# EAGLE design ETEST02 (EAGLE 7.3.0)
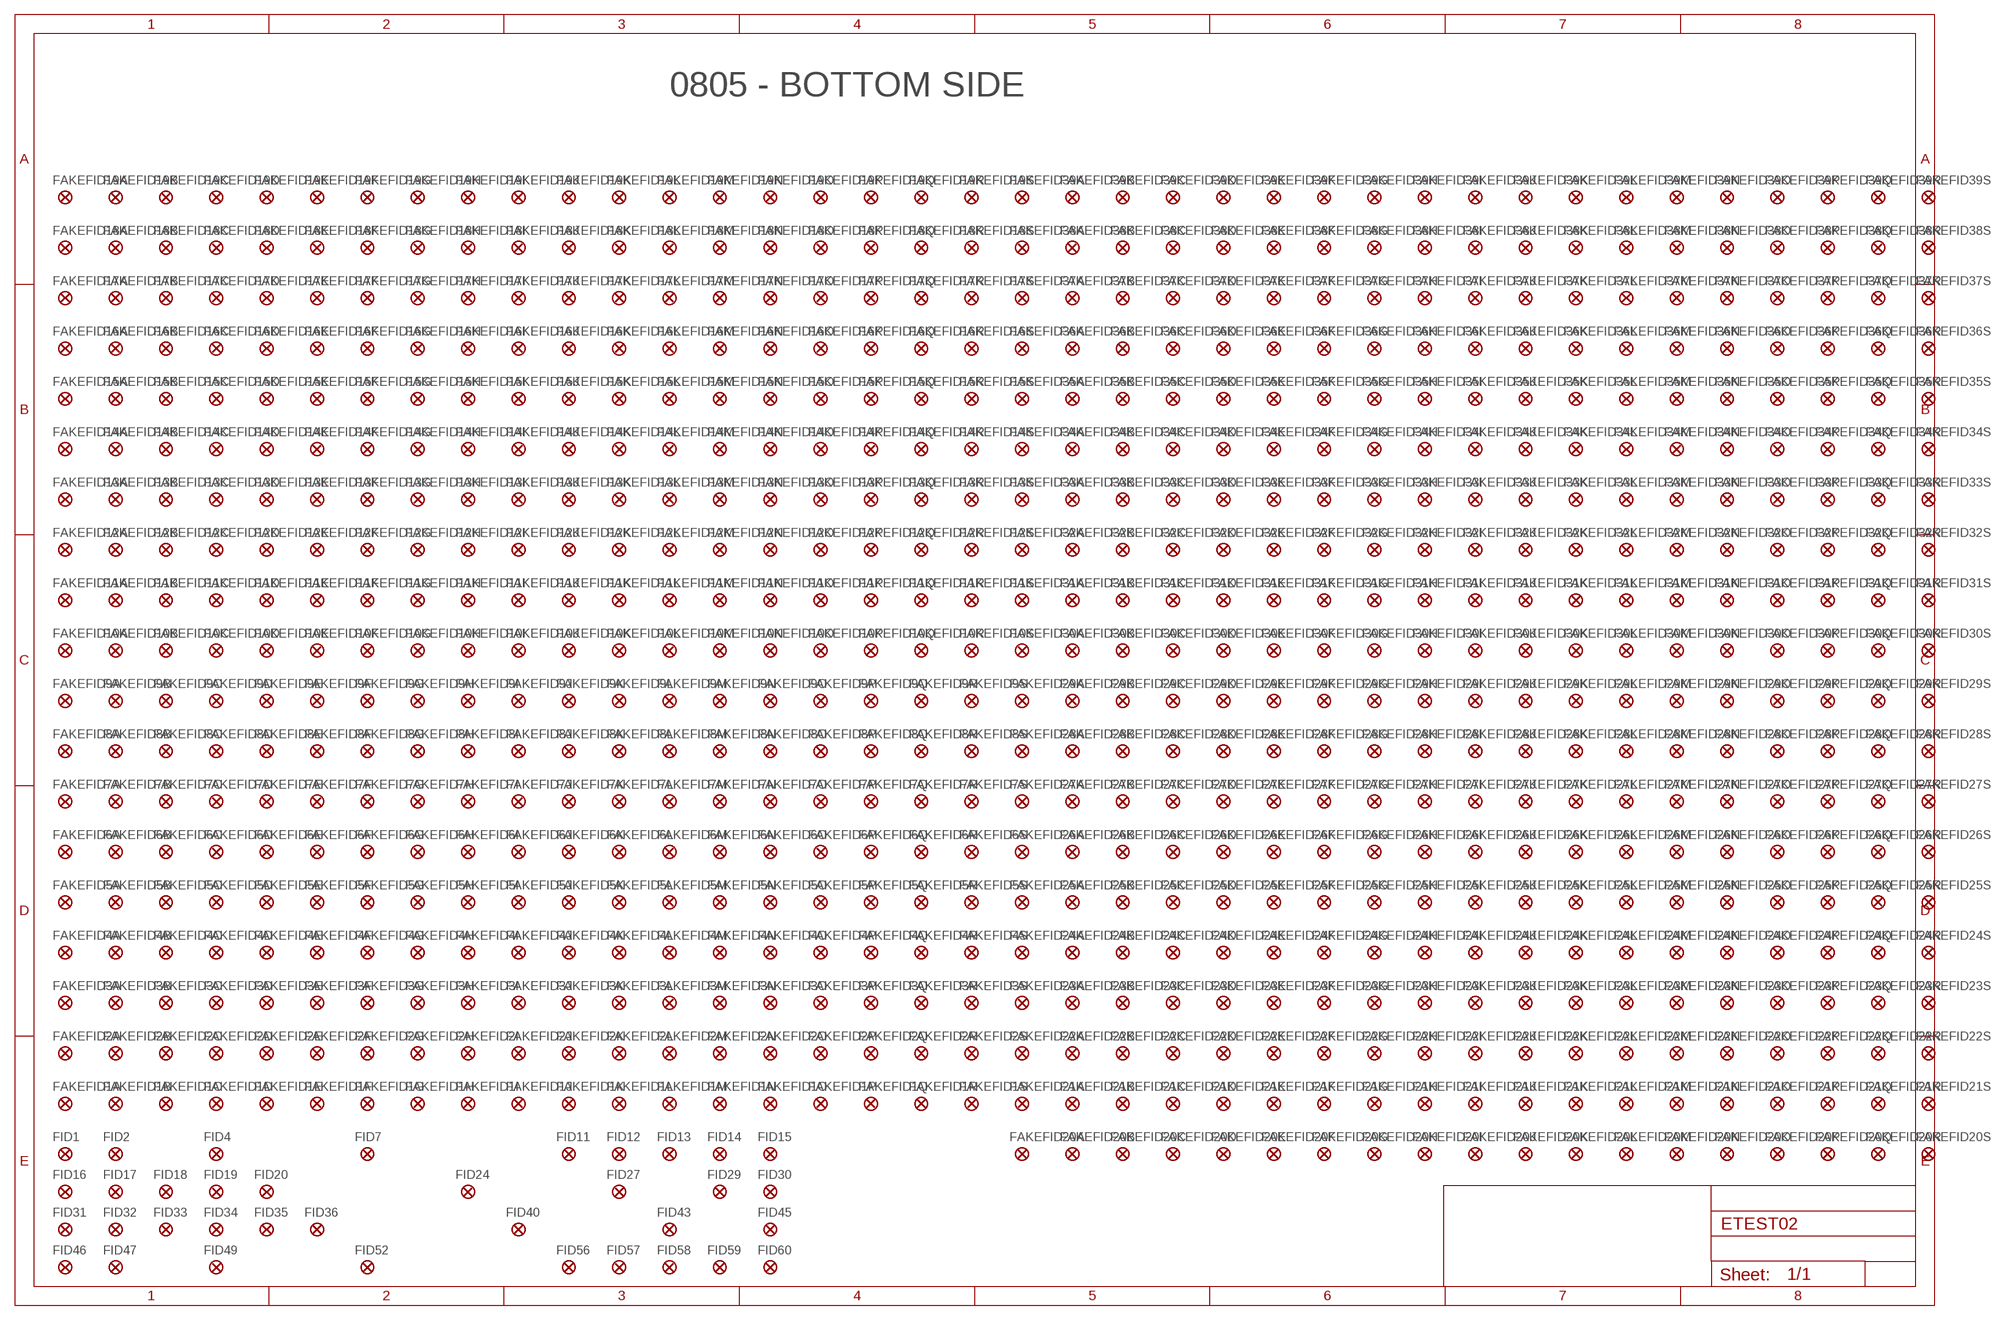
[diagram p0: schematic, sheet 1]

## Parts
FAKEFID1  FIDUCIAL_19X  [FIDUCIAL_19X]
FAKEFID2  FIDUCIAL_19X  [FIDUCIAL_19X]
FAKEFID3  FIDUCIAL_19X  [FIDUCIAL_19X]
FAKEFID4  FIDUCIAL_19X  [FIDUCIAL_19X]
FAKEFID5  FIDUCIAL_19X  [FIDUCIAL_19X]
FAKEFID6  FIDUCIAL_19X  [FIDUCIAL_19X]
FAKEFID7  FIDUCIAL_19X  [FIDUCIAL_19X]
FAKEFID8  FIDUCIAL_19X  [FIDUCIAL_19X]
FAKEFID9  FIDUCIAL_19X  [FIDUCIAL_19X]
FAKEFID10  FIDUCIAL_19X  [FIDUCIAL_19X]
FAKEFID11  FIDUCIAL_19X  [FIDUCIAL_19X]
FAKEFID12  FIDUCIAL_19X  [FIDUCIAL_19X]
FAKEFID13  FIDUCIAL_19X  [FIDUCIAL_19X]
FAKEFID14  FIDUCIAL_19X  [FIDUCIAL_19X]
FAKEFID15  FIDUCIAL_19X  [FIDUCIAL_19X]
FAKEFID16  FIDUCIAL_19X  [FIDUCIAL_19X]
FAKEFID17  FIDUCIAL_19X  [FIDUCIAL_19X]
FAKEFID18  FIDUCIAL_19X  [FIDUCIAL_19X]
FAKEFID19  FIDUCIAL_19X  [FIDUCIAL_19X]
FAKEFID20  FIDUCIAL_19X  [FIDUCIAL_19X]
FAKEFID21  FIDUCIAL_19X  [FIDUCIAL_19X]
FAKEFID22  FIDUCIAL_19X  [FIDUCIAL_19X]
FAKEFID23  FIDUCIAL_19X  [FIDUCIAL_19X]
FAKEFID24  FIDUCIAL_19X  [FIDUCIAL_19X]
FAKEFID25  FIDUCIAL_19X  [FIDUCIAL_19X]
FAKEFID26  FIDUCIAL_19X  [FIDUCIAL_19X]
FAKEFID27  FIDUCIAL_19X  [FIDUCIAL_19X]
FAKEFID28  FIDUCIAL_19X  [FIDUCIAL_19X]
FAKEFID29  FIDUCIAL_19X  [FIDUCIAL_19X]
FAKEFID30  FIDUCIAL_19X  [FIDUCIAL_19X]
FAKEFID31  FIDUCIAL_19X  [FIDUCIAL_19X]
FAKEFID32  FIDUCIAL_19X  [FIDUCIAL_19X]
FAKEFID33  FIDUCIAL_19X  [FIDUCIAL_19X]
FAKEFID34  FIDUCIAL_19X  [FIDUCIAL_19X]
FAKEFID35  FIDUCIAL_19X  [FIDUCIAL_19X]
FAKEFID36  FIDUCIAL_19X  [FIDUCIAL_19X]
FAKEFID37  FIDUCIAL_19X  [FIDUCIAL_19X]
FAKEFID38  FIDUCIAL_19X  [FIDUCIAL_19X]
FAKEFID39  FIDUCIAL_19X  [FIDUCIAL_19X]
FID1  FIDUCIAL  [FIDUCIAL]
FID2  FIDUCIAL  [FIDUCIAL]
FID4  FIDUCIAL  [FIDUCIAL]
FID7  FIDUCIAL  [FIDUCIAL]
FID11  FIDUCIAL  [FIDUCIAL]
FID12  FIDUCIAL  [FIDUCIAL]
FID13  FIDUCIAL  [FIDUCIAL]
FID14  FIDUCIAL  [FIDUCIAL]
FID15  FIDUCIAL  [FIDUCIAL]
FID16  FIDUCIAL  [FIDUCIAL]
FID17  FIDUCIAL  [FIDUCIAL]
FID18  FIDUCIAL  [FIDUCIAL]
FID19  FIDUCIAL  [FIDUCIAL]
FID20  FIDUCIAL  [FIDUCIAL]
FID24  FIDUCIAL  [FIDUCIAL]
FID27  FIDUCIAL  [FIDUCIAL]
FID29  FIDUCIAL  [FIDUCIAL]
FID30  FIDUCIAL  [FIDUCIAL]
FID31  FIDUCIAL  [FIDUCIAL]
FID32  FIDUCIAL  [FIDUCIAL]
FID33  FIDUCIAL  [FIDUCIAL]
FID34  FIDUCIAL  [FIDUCIAL]
FID35  FIDUCIAL  [FIDUCIAL]
FID36  FIDUCIAL  [FIDUCIAL]
FID40  FIDUCIAL  [FIDUCIAL]
FID43  FIDUCIAL  [FIDUCIAL]
FID45  FIDUCIAL  [FIDUCIAL]
FID46  FIDUCIAL  [FIDUCIAL]
FID47  FIDUCIAL  [FIDUCIAL]
FID49  FIDUCIAL  [FIDUCIAL]
FID52  FIDUCIAL  [FIDUCIAL]
FID56  FIDUCIAL  [FIDUCIAL]
FID57  FIDUCIAL  [FIDUCIAL]
FID58  FIDUCIAL  [FIDUCIAL]
FID59  FIDUCIAL  [FIDUCIAL]
FID60  FIDUCIAL  [FIDUCIAL]

## Notes on the sheet
- 0805 - BOTTOM SIDE

## Library data of the parts
FAKEFID1-FAKEFID39 = TinWhiskers:FIDUCIAL_19X
FID1 FID2 FID4 FID7 FID11-FID20 FID24 FID27 FID29-FID36 FID40 FID43 FID45-FID47 FID49 FID52 FID56-FID60 = TinWhiskers:FIDUCIAL

## Board
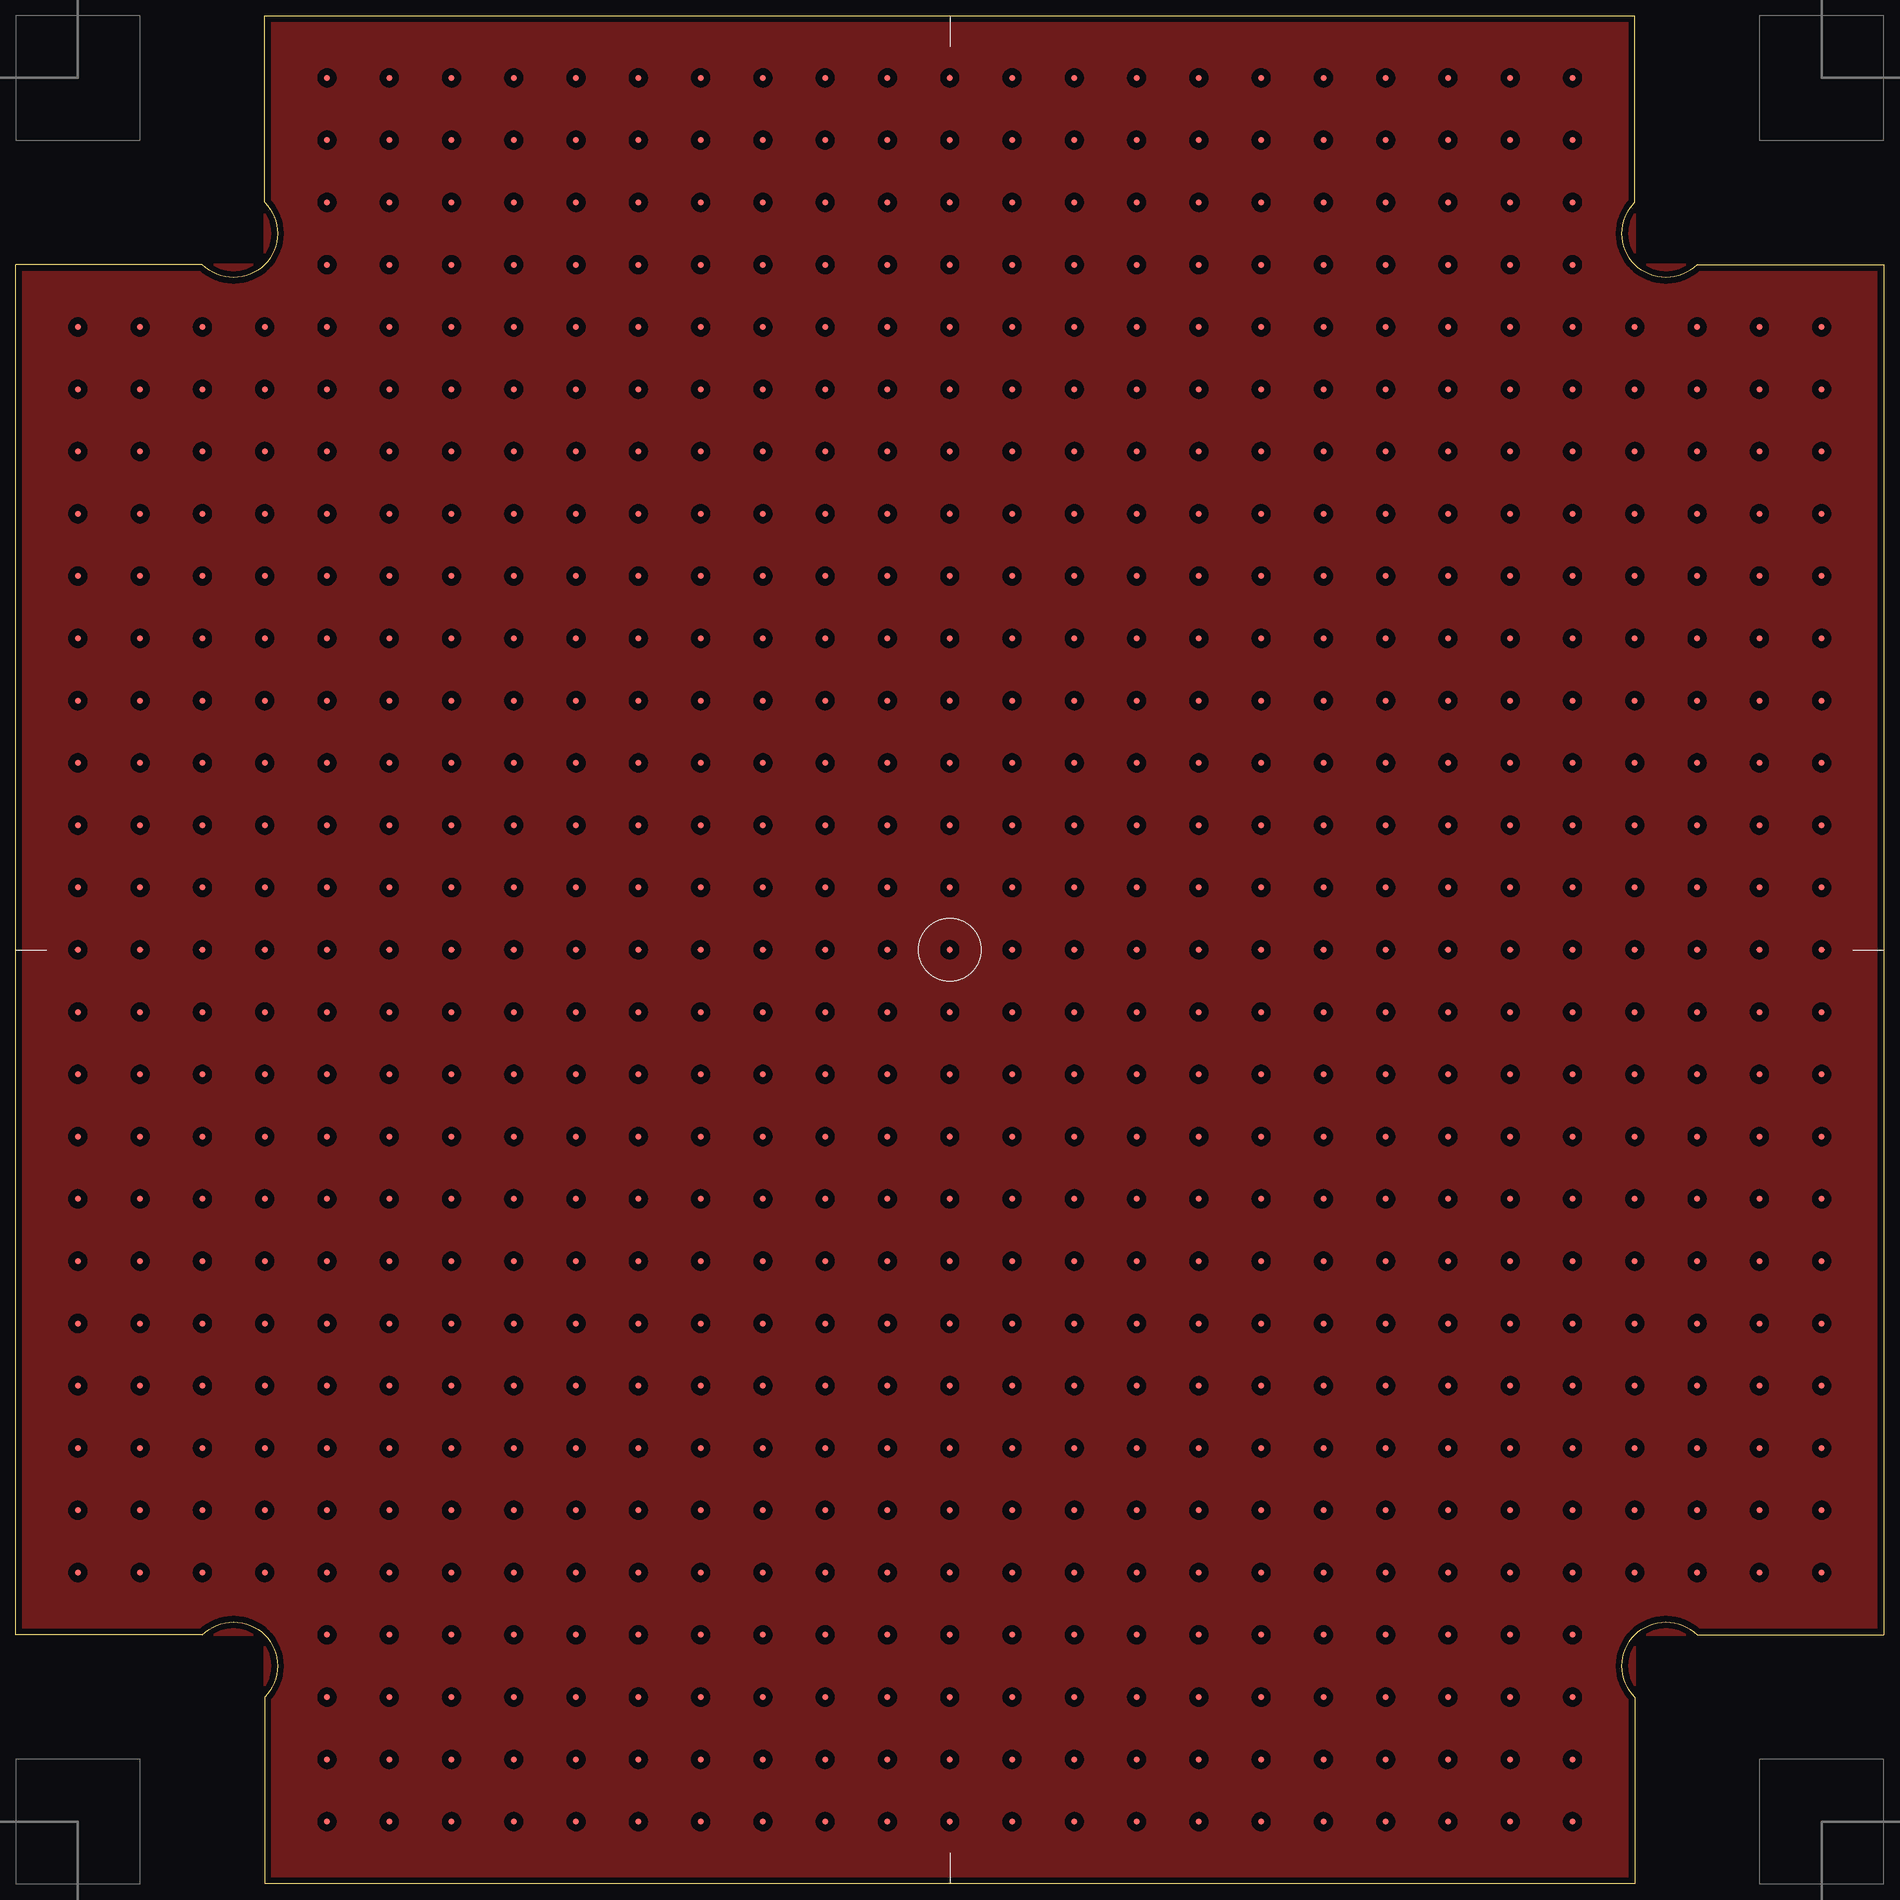
[diagram p1: board, top side]

Size 300 x 300 mm. Coordinates in mm from the lower left corner, seen from the top.
Outline: 40,300 260,300 260,270 arc180 270,260 300,260 300,40 270,40 arc180 260,30 260,0 40,0 40,30 arc180 30,40 0,40 0,260 30,260 arc180 40,270 40,300
Copper layers (1*16): Top 0.035mm / dielectric 1.5mm / Bottom 0.035mm
Design rules "default": minimum track width 10mil, minimum drill 24mil, track to track 8mil, track to pad 8mil, pad to pad 8mil, via to via 8mil, smd to smd 8mil, copper to edge 40mil, drill to drill 8mil, minimum pad ring 10mil, minimum via ring 8mil, stop-mask expansion 4mil, vias tented up to drill 0mil, thermal gap 10mil

### Footprints (pad centres in the part's own frame; a part is rotated, then mirrored left to right if it is on the bottom)
FIDUCIAL_19X = smd 1 x 1: 1 -90,0; 2 -80,0; 3 -70,0; 4 -60,0; 5 -50,0; 6 -40,0; 7 -30,0; 8 -20,0; 9 -10,0; 10 0,0; 11 10,0; 12 20,0; 13 30,0; 14 40,0; 15 50,0; 16 60,0; 17 70,0; 18 80,0; 19 90,0
FIDUCIAL = smd 1 x 1: 1 0,0

### Placement (x,y rotation side)
FAKEFID1  150,10 0 top
FAKEFID2  150,20 0 top
FAKEFID3  150,30 0 top
FAKEFID4  150,40 0 top
FAKEFID5  150,50 0 top
FAKEFID6  150,60 0 top
FAKEFID7  150,70 0 top
FAKEFID8  150,80 0 top
FAKEFID9  150,90 0 top
FAKEFID10  150,100 0 top
FAKEFID11  150,110 0 top
FAKEFID12  150,120 0 top
FAKEFID13  150,130 0 top
FAKEFID14  150,140 0 top
FAKEFID15  150,150 0 top
FAKEFID16  150,160 0 top
FAKEFID17  150,170 0 top
FAKEFID18  150,180 0 top
FAKEFID19  150,190 0 top
FAKEFID20  150,200 0 top
FAKEFID21  150,210 0 top
FAKEFID22  150,220 0 top
FAKEFID23  150,230 0 top
FAKEFID24  150,240 0 top
FAKEFID25  150,250 0 top
FAKEFID26  150,260 0 top
FAKEFID27  150,270 0 top
FAKEFID28  150,280 0 top
FAKEFID29  150,290 0 top
FAKEFID30  290,150 270 top
FAKEFID31  280,150 270 top
FAKEFID32  270,150 270 top
FAKEFID33  260,150 270 top
FAKEFID34  250,150 270 top
FAKEFID35  10,150 270 top
FAKEFID36  20,150 270 top
FAKEFID37  30,150 270 top
FAKEFID38  40,150 270 top
FAKEFID39  50,150 270 top
FID1  50,290 0 top
FID2  50,280 0 top
FID4  50,270 0 top
FID7  50,260 0 top
FID11  50,250 0 top
FID12  40,250 0 top
FID13  30,250 0 top
FID14  20,250 0 top
FID15  10,250 0 top
FID16  10,50 0 top
FID17  20,50 0 top
FID18  30,50 0 top
FID19  40,50 0 top
FID20  50,50 0 top
FID24  50,40 0 top
FID27  50,30 0 top
FID29  50,20 0 top
FID30  50,10 0 top
FID31  250,50 0 top
FID32  260,50 0 top
FID33  270,50 0 top
FID34  280,50 0 top
FID35  290,50 0 top
FID36  250,40 0 top
FID40  250,30 0 top
FID43  250,20 0 top
FID45  250,10 0 top
FID46  250,290 0 top
FID47  250,280 0 top
FID49  250,270 0 top
FID52  250,260 0 top
FID56  250,250 0 top
FID57  260,250 0 top
FID58  270,250 0 top
FID59  280,250 0 top
FID60  290,250 0 top

### Tracks (layer width: path | path; a pad name or v marks a point on that pad's centre or on a via)
N$716
  pour Top (isolate 0.5): 300,260 260,260 260,300 40,300 40,260 0,260 0,40 40,40 40,0 260,0 260,40 300,40